# Altium project 开发板.PrjPCB
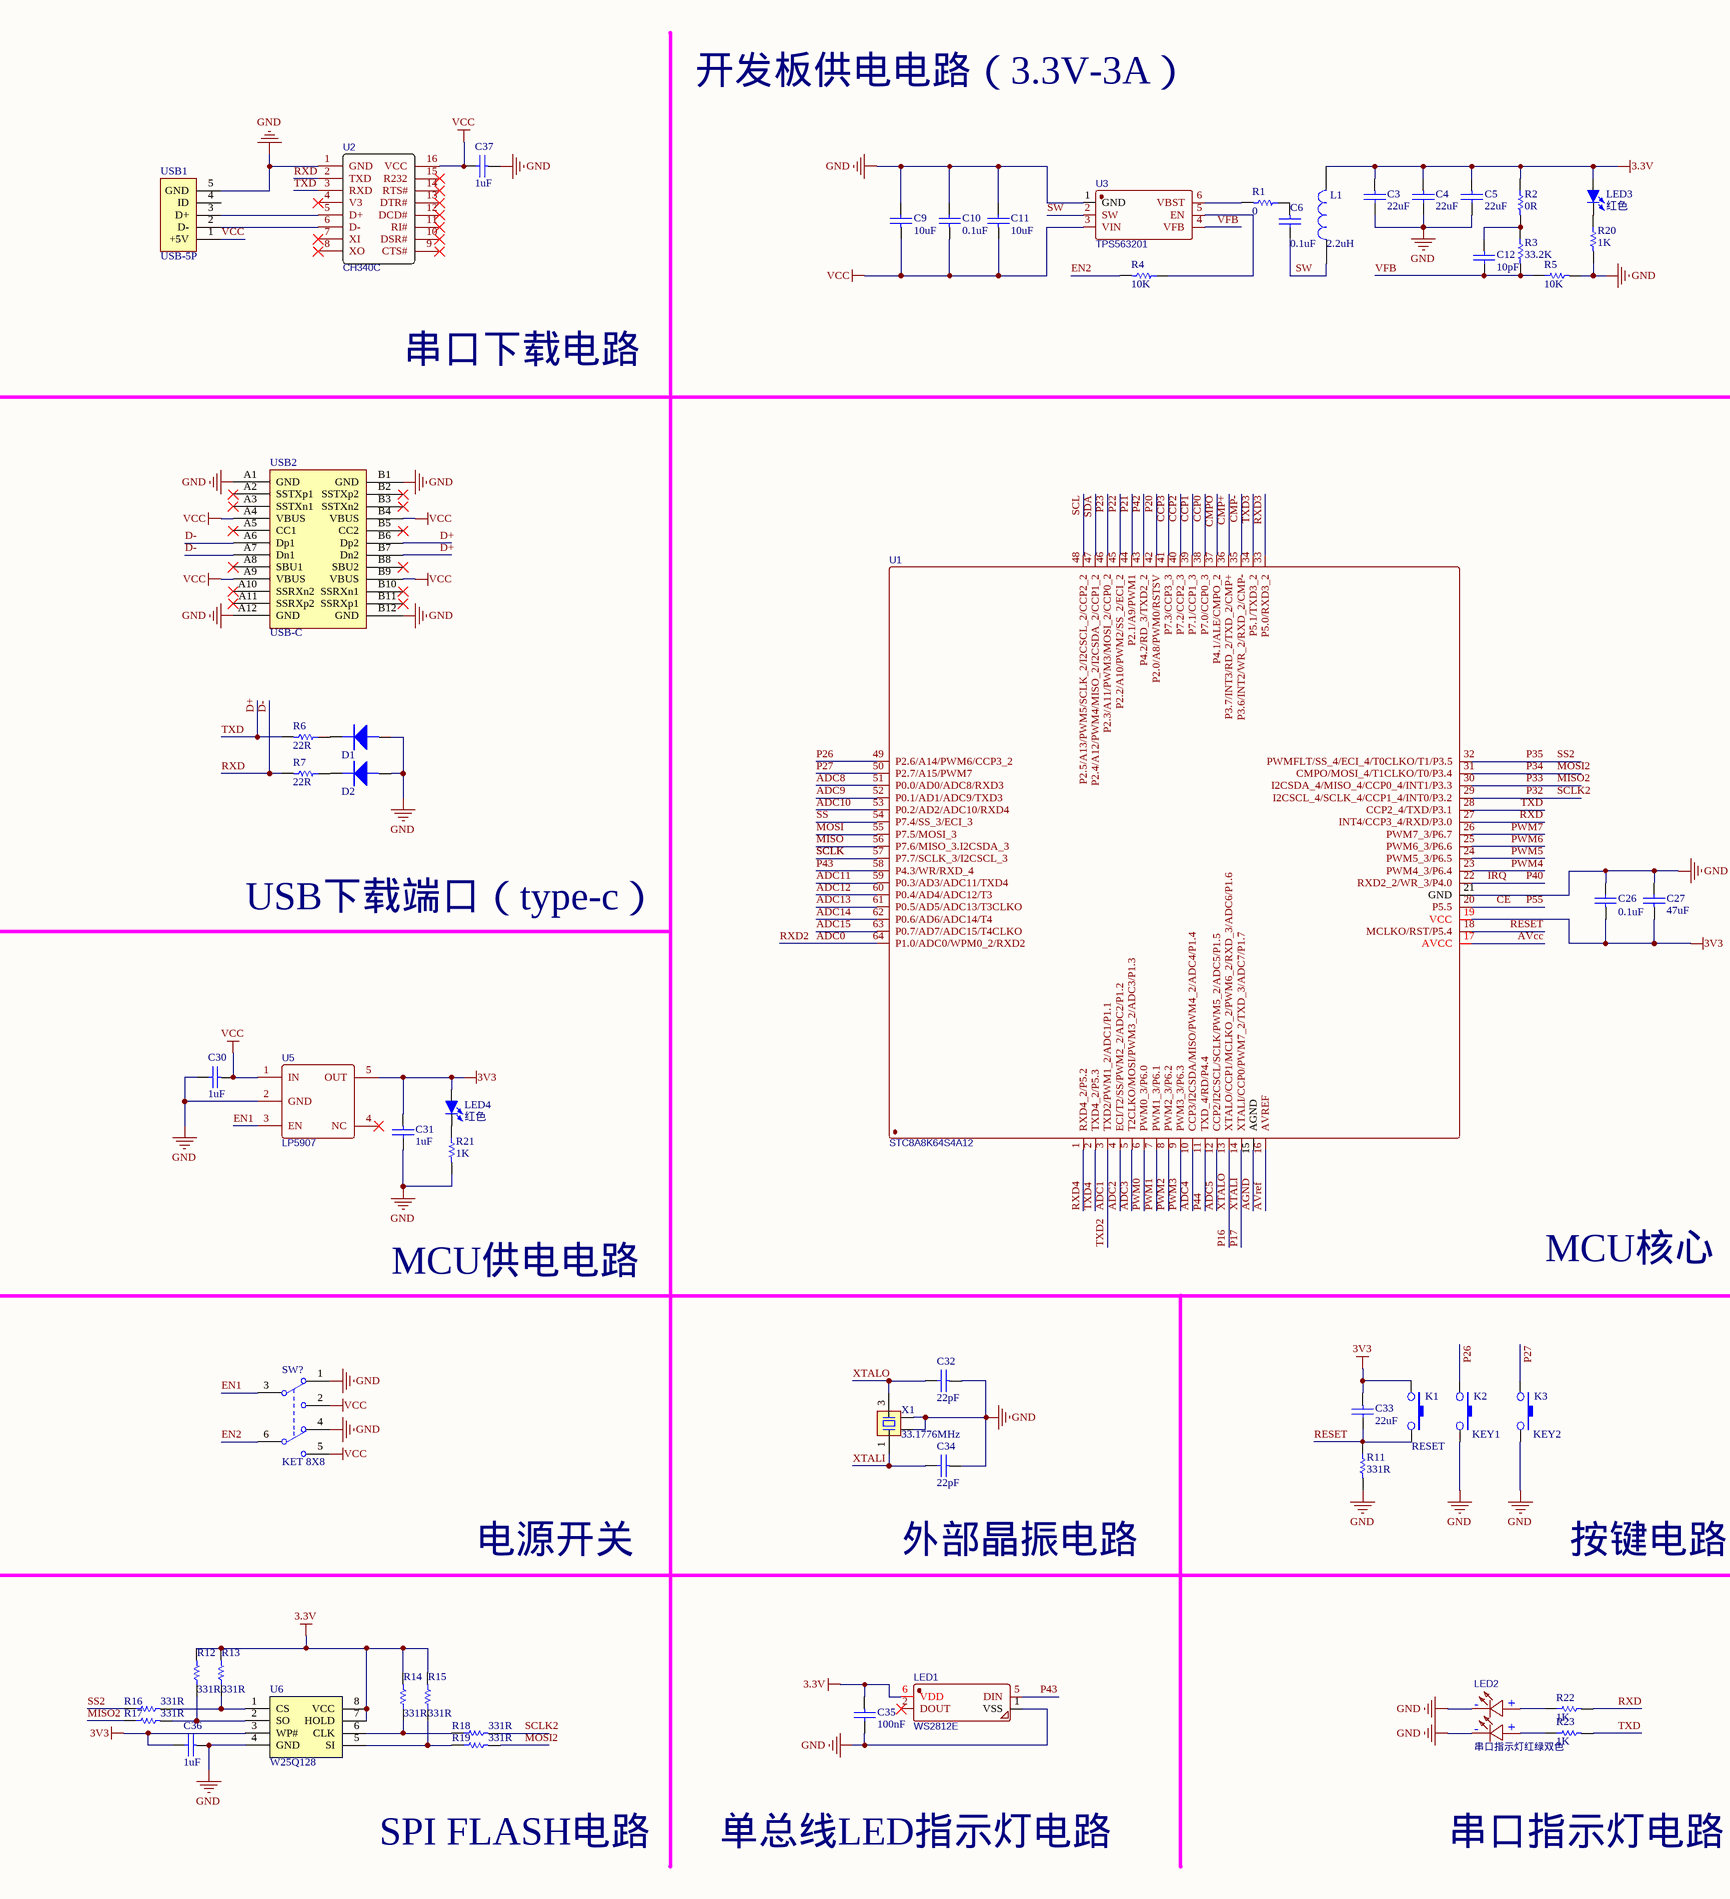
[diagram p0: 开发板.SchDoc, left]
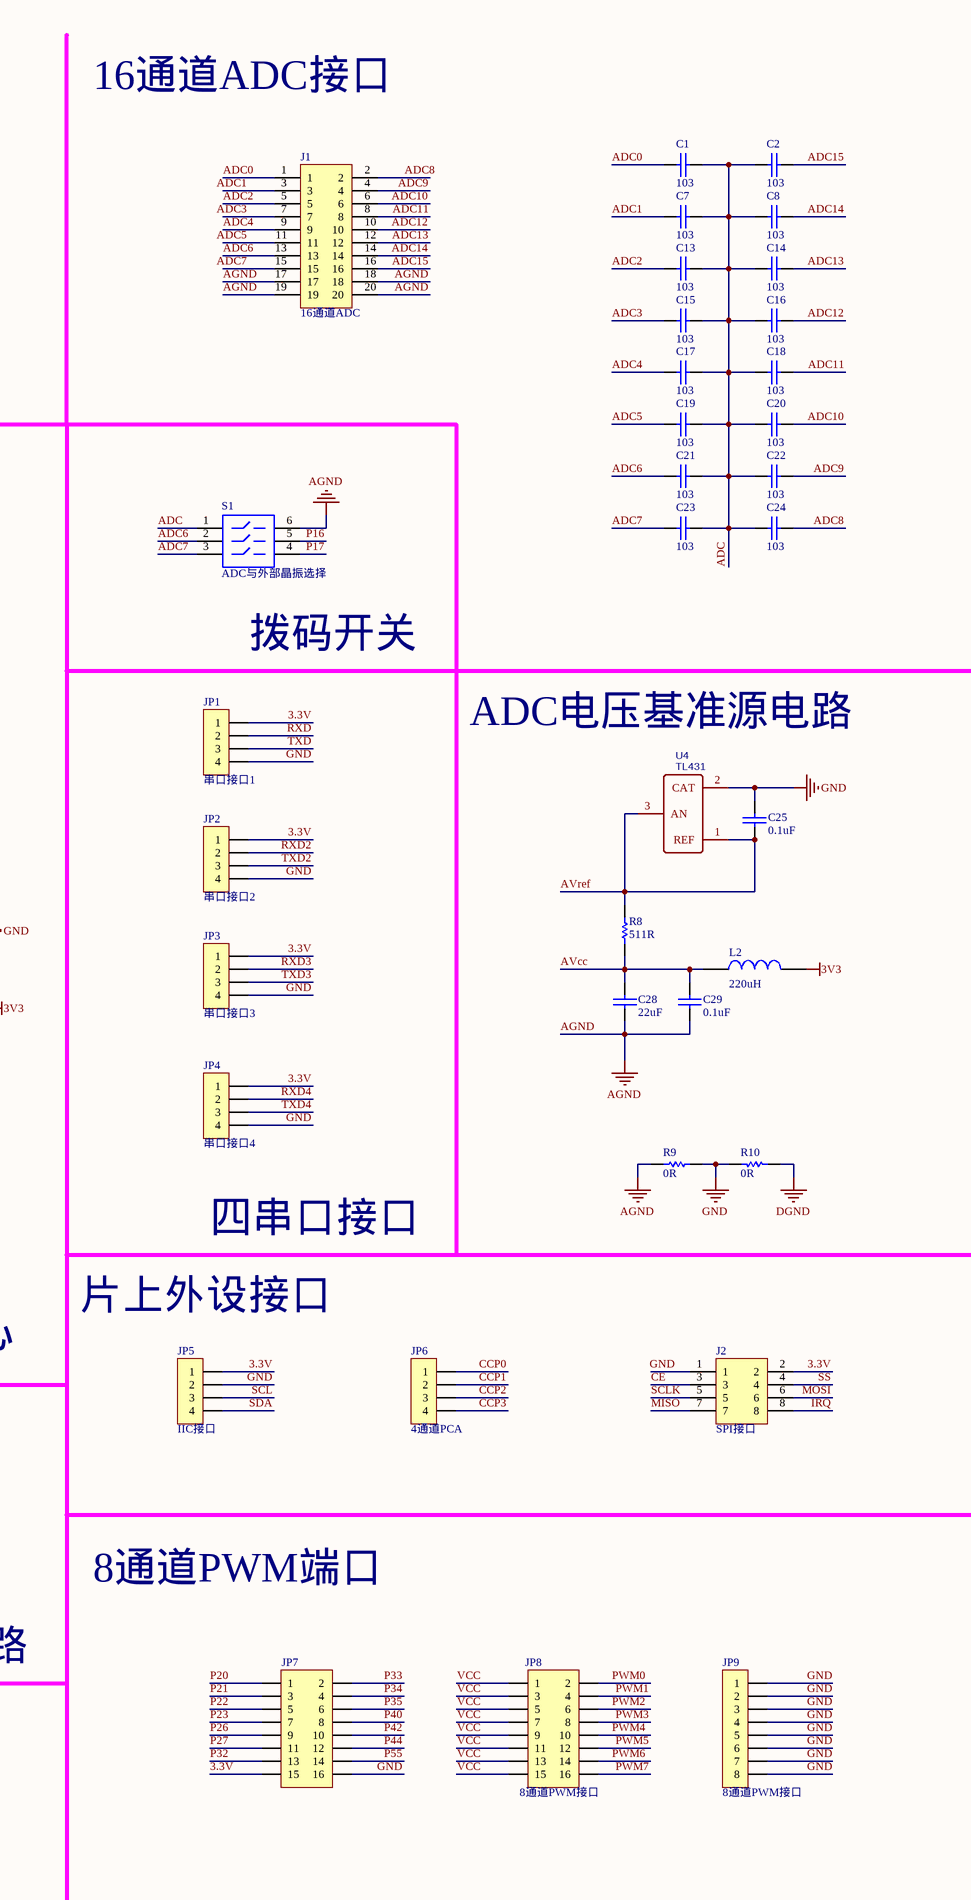
[diagram p1: 开发板.SchDoc, right]
1 sheet, 93 parts. Net scope: global (net labels, ports and power ports of the same name join across sheets).
Board file: 开发板.PcbDoc

## Sheet 开发板.SchDoc
size A2

### Parts
C1  103  [0603C]
C2  103  [0603C]
C3  22uF  [1206C]
C4  22uF  [1206C]
C5  22uF  [1206C]
C6  0.1uF  [0603C]
C7  103  [0603C]
C8  103  [0603C]
C9  10uF  [1206C]
C10  0.1uF  [0603C]
C11  10uF  [1206C]
C12  10pF  [0603C]
C13  103  [0603C]
C14  103  [0603C]
C15  103  [0603C]
C16  103  [0603C]
C17  103  [0603C]
C18  103  [0603C]
C19  103  [0603C]
C20  103  [0603C]
C21  103  [0603C]
C22  103  [0603C]
C23  103  [0603C]
C24  103  [0603C]
C25  0.1uF  [0603C]
C26  0.1uF  [0603C]
C27  47uF  [0603C]
C28  22uF  [0603C]
C29  0.1uF  [0603C]
C30  1uF  [0603C]
C31  1uF  [0603C]
C32  22pF  [0603C]
C33  22uF  [1206C]
C34  22pF  [0603C]
C35  100nF  [0603C]
C36  1uF  [0603C]
C37  1uF  [0603C]
D1  DIODE  [LL34]  (value not drawn)
D2  DIODE  [LL34]  (value not drawn)
J1  16通道ADC  [Pin HDR2X10/2.54mm-S]
J2  SPI接口  [Fe-HDR2X4/2.54-S]
JP1  串口接口1  [HDR2.54-LI-4P]
JP2  串口接口2  [HDR2.54-LI-4P]
JP3  串口接口3  [HDR2.54-LI-4P]
JP4  串口接口4  [HDR2.54-LI-4P]
JP5  IIC接口  [HDR2.54-M-LI-4P]
JP6  4通道PCA  [HDR2.54-LI-4P]
JP7  Header 8X2  [HDR2.54-LI-2x8P]  (value not drawn)
JP8  8通道PWM接口  [HDR2.54-LI-2x8P]
JP9  8通道PWM接口  [HDR2.54-LI-8P]
K1  RESET  [SMD-3X6X4.3]
K2  KEY1  [SMD-3X6X4.3]
K3  KEY2  [SMD-3X6X4.3]
L1  2.2uH  [CD32]
L2  220uH  [0603L]
LED1  WS2812E  [LED 5050]
LED2  串口指示灯红绿双色  [LED 1615-R/B]
LED3  红色  [LED 0603Y]
LED4  红色  [LED 0603R]
R1  0  [0603R]
R2  0R  [0603R]
R3  33.2K  [0603R]
R4  10K  [0603R]
R5  10K  [0603R]
R6  22R  [0603R]
R7  22R  [0603R]
R8  511R  [0603R]
R9  0R  [0603R]
R10  0R  [0603R]
R11  331R  [0603R]
R12  331R  [0603R]
R13  331R  [0603R]
R14  331R  [0603R]
R15  331R  [0603R]
R16  331R  [0603R]
R17  331R  [0603R]
R18  331R  [0603R]
R19  331R  [0603R]
R20  1K  [0603R]
R21  1K  [0603R]
R22  1K  [0603R]
R23  1K  [0603R]
S1  ADC与外部晶振选择  [DIP-Switch3]
SW?  KET 8X8  [KFT DIP-8X8]
U1  STC8A8K64S4A12  [LQFP64-10*10]
U2  CH340C  [SOP16]
U3  TPS563201  [SOT23-6]
U4  TL431  [SOT23]
U5  LP5907  [SOT23-5]
U6  W25Q128  [SOIC8]
USB1  USB-5P  [USB-MICRO_B]
USB2  USB-C  [USB-C/S_A]
X1  33.1776MHz  [OSC 1612-4P]

### Nets
3.3V: C3.1 C4.1 C5.1 C35.1 J2.2 JP1.1 JP2.1 JP3.1 JP4.1 JP5.1 JP7.15 L1.2 LED1.6(VDD) LED3.1(A) R2.1 R12.2 R13.2 R14.2 R15.2 U6.7(HOLD) U6.8(VCC)
3V3: C26.1 C27.1 C31.1 C33.1 C36.2 K1.1 L2.1 LED4.1(A) U1.19(VCC) U5.5(OUT) U6.3(WP#)
AGND: C28.1 C29.1 J1.17 J1.18 J1.19 J1.20 R9.2 S1.6(B1) U1.15(AGND)
DGND: R10.2
GND: C3.2 C4.2 C5.2 C9.2 C10.2 C11.2 C25.2 C26.2 C27.2 C30.2 C31.2 C32.1 C34.1 C35.2 C36.1 C37.1 D1.A D2.A J2.1 JP1.4 JP2.4 JP3.4 JP4.4 JP5.2 JP7.16 JP9.1 JP9.2 JP9.3 JP9.4 JP9.5 JP9.6 JP9.7 JP9.8 K2.3 K3.3 LED1.1(VSS) LED2.2 LED2.4 R5.2 R9.1 R10.1 R11.2 R20.2 R21.2 SW?.1(NC1) SW?.4(NO2) U1.21(GND) U2.1(GND) U3.1(GND) U4.2(CAT) U5.2(GND) U6.4(GND) USB1.5(GND) USB2.A1(GND) USB2.A12(GND) USB2.B1(GND) USB2.B12(GND) X1.2 X1.4
VCC: C9.1 C10.1 C11.1 C30.1 C37.2 JP8.1 JP8.3 JP8.5 JP8.7 JP8.9 JP8.11 JP8.13 JP8.15 SW?.2(COM2) SW?.5(COM2) U2.16(VCC) U3.3(VIN) U5.1(IN) USB1.1(+5V) USB2.A4(VBUS) USB2.A9(VBUS) USB2.B4(VBUS) USB2.B9(VBUS)
ADC: C1.2 C2.1 C7.2 C8.1 C13.2 C14.1 C15.2 C16.1 C17.2 C18.1 C19.2 C20.1 C21.2 C22.1 C23.2 C24.1 S1.1(A1)
ADC0: C1.1 J1.1 JP2.2 U1.64(P1.0/ADC0/WPM0_2/RXD2)  [also labelled RXD2]
ADC1: C7.1 J1.3 JP2.3 U1.3(TXD2/PWM1_2/ADC1/P1.1)  [also labelled TXD2]
ADC2: C13.1 J1.5 U1.4(ECI/T2/SS/PWM2_2/ADC2/P1.2)
ADC3: C15.1 J1.7 U1.5(T2CLKO/MOSI/PWM3_2/ADC3/P1.3)
ADC4: C17.1 J1.9 U1.10(CCP3/I2CSDA/MISO/PWM4_2/ADC4/P1.4)
ADC5: C19.1 J1.11 U1.12(CCP2/I2CSCL/SCLK/PWM5_2/ADC5/P1.5)
ADC6: C21.1 J1.13 S1.2(A2)
ADC7: C23.1 J1.15 S1.3(A3)
ADC8: C24.2 J1.2 U1.51(P0.0/AD0/ADC8/RXD3)
ADC9: C22.2 J1.4 U1.52(P0.1/AD1/ADC9/TXD3)
ADC10: C20.2 J1.6 U1.53(P0.2/AD2/ADC10/RXD4)
ADC11: C18.2 J1.8 U1.59(P0.3/AD3/ADC11/TXD4)
ADC12: C16.2 J1.10 U1.60(P0.4/AD4/ADC12/T3)
ADC13: C14.2 J1.12 U1.61(P0.5/AD5/ADC13/T3CLKO)
ADC14: C8.2 J1.14 U1.62(P0.6/AD6/ADC14/T4)
ADC15: C2.2 J1.16 U1.63(P0.7/AD7/ADC15/T4CLKO)
AVcc: C28.2 C29.2 L2.2 R8.1 U1.17(AVCC)
AVref: C25.1 R8.2 U1.16(AVREF) U4.1(REF) U4.3(AN)
CCP0: JP6.1 U1.38(P7.0/CCP0_3)
CCP1: JP6.2 U1.39(P7.1/CCP1_3)
CCP2: JP6.3 U1.40(P7.2/CCP2_3)
CCP3: JP6.4 U1.41(P7.3/CCP3_3)
CE: J2.3 JP7.14 U1.20(P5.5)  [also labelled P55]
CMP+: U1.36(P3.7/INT3/RD_2/TXD_2/CMP+)
CMP-: U1.35(P3.6/INT2/WR_2/RXD_2/CMP-)
CMPO: U1.37(P4.1/ALE/CMPO_2)
D+: JP1.3 R6.2 R23.2 U1.28(CCP2_4/TXD/P3.1) U2.3(RXD) USB2.B6(Dp2) USB2.B7(Dn2)  [also labelled TXD]
D-: JP1.2 R7.2 R22.2 U1.27(INT4/CCP3_4/RXD/P3.0) U2.2(TXD) USB2.A6(Dp1) USB2.A7(Dn1)  [also labelled RXD]
EN1: SW?.3(NO1) U5.3(EN)
EN2: R4.2 SW?.6(NC2)
IRQ: J2.8 JP7.8 U1.22(RXD2_2/WR_3/P4.0)  [also labelled P40]
MISO: J2.7 U1.56(P7.6/MISO_3.I2CSDA_3)
MISO2: JP7.2 R17.1 U1.30(I2CSDA_4/MISO_4/CCP0_4/INT1/P3.3)  [also labelled P33]
MOSI: J2.6 U1.55(P7.5/MOSI_3)
MOSI2: JP7.4 R19.2 U1.31(CMPO/MOSI_4/T1CLKO/T0/P3.4)  [also labelled P34]
P16: C32.2 S1.5(B2) U1.13(XTALO/CCP1/MCLKO_2/PWM6_2/RXD_3/ADC6/P1.6) X1.3  [also labelled XTALO]
P17: C34.2 S1.4(B3) U1.14(XTALI/CCP0/PWM7_2/TXD_3/ADC7/P1.7) X1.1  [also labelled XTALI]
P20: JP7.1 U1.42(P2.0/A8/PWM0/RSTSV)
P21: JP7.3 U1.44(P2.1/A9/PWM1)
P22: JP7.5 U1.45(P2.2/A10/PWM2/SS_2/ECI_2)
P23: JP7.7 U1.46(P2.3/A11/PWM3/MOSI_2/CCP0_2)
P26: JP7.9 K2.1 U1.49(P2.6/A14/PWM6/CCP3_2)
P27: JP7.11 K3.1 U1.50(P2.7/A15/PWM7)
P32: JP7.13 R18.2 U1.29(I2CSCL_4/SCLK_4/CCP1_4/INT0/P3.2)  [also labelled SCLK2]
P35: JP7.6 R16.1 U1.32(PWMFLT/SS_4/ECI_4/T0CLKO/T1/P3.5)  [also labelled SS2]
P42: JP7.10 U1.43(P4.2/RD_3/TXD2_2)
P43: LED1.5(DIN) U1.58(P4.3/WR/RXD_4)
P44: JP7.12 U1.11(TXD_4/RD/P4.4)
PWM0: JP8.2 U1.6(PWM0_3/P6.0)
PWM1: JP8.4 U1.7(PWM1_3/P6.1)
PWM2: JP8.6 U1.8(PWM2_3/P6.2)
PWM3: JP8.8 U1.9(PWM3_3/P6.3)
PWM4: JP8.10 U1.23(PWM4_3/P6.4)
PWM5: JP8.12 U1.24(PWM5_3/P6.5)
PWM6: JP8.14 U1.25(PWM6_3/P6.6)
PWM7: JP8.16 U1.26(PWM7_3/P6.7)
RESET: C33.2 K1.3 R11.1 U1.18(MCLKO/RST/P5.4)
RXD3: JP3.2 U1.33(P5.0/RXD3_2)
RXD4: JP4.2 U1.1(RXD4_2/P5.2)
SCL: JP5.3 U1.48(P2.5/A13/PWM5/SCLK_2/I2CSCL_2/CCP2_2)
SCLK: J2.5 U1.57(P7.7/SCLK_3/I2CSCL_3)
SDA: JP5.4 U1.47(P2.4/A12/PWM4/MISO_2/I2CSDA_2/CCP1_2)
SS: J2.4 U1.54(P7.4/SS_3/ECI_3)
SW: C6.2 L1.1 U3.2(SW)
TXD3: JP3.3 U1.34(P5.1/TXD3_2)
TXD4: JP4.3 U1.2(TXD4_2/P5.3)
VFB: C12.2 R3.2 R5.1 U3.4(VFB)
NetC6_1: C6.1 R1.1
NetC12_1: C12.1 R2.2 R3.1
NetD1_K: D1.K R6.1
NetD2_K: D2.K R7.1
NetLED2_1: LED2.1 R22.1
NetLED2_3: LED2.3 R23.1
NetLED3_2: LED3.2(K) R20.1
NetLED4_2: LED4.2(K) R21.1
NetR1_2: R1.2 U3.6(VBST)
NetR4_1: R4.1 U3.5(EN)
NetR12_1: R12.1 R17.2 U6.2(SO)
NetR13_1: R13.1 R16.2 U6.1(CS)
NetR14_1: R14.1 R18.1 U6.6(CLK)
NetR15_1: R15.1 R19.1 U6.5(SI)
NetU2_5: U2.5(D+) USB1.3(D+)
NetU2_6: U2.6(D-) USB1.2(D-)

Not connected (* = marked no-connect by the designer): LED1 2(DOUT)*; U2 4(V3)* 7(XI)* 8(XO)* 9(CTS#)* 10(DSR#)* 11(RI#)* 12(DCD#)* 13(DTR#)* 14(RTS#)* 15(R232)*; U5 4(NC)*; USB1 4(ID); USB2 A2(SSTXp1)* A3(SSTXn1)* A5(CC1)* A8(SBU1)* A10(SSRXn2)* A11(SSRXp2)* B2(SSTXp2)* B3(SSTXn2)* B5(CC2)* B8(SBU2)* B10(SSRXn1)* B11(SSRXp1)*

### Notes on the sheet
- 开发板供电电路（3.3V-3A）
- 16通道ADC接口
- 串口下载电路
- 拨码开关
- ADC电压基准源电路
- USB下载端口（type-c）
- 四串口接口
- 片上外设接口
- MCU供电电路
- MCU核心
- 8通道PWM端口
- 电源开关
- 外部晶振电路
- 按键电路
- SPI FLASH电路
- 单总线LED指示灯电路
- 串口指示灯电路
- (in symbol TJ-S1615SW6TGLCRY-A5) -; +

### Library data of the parts
C1-C37 = CAP: 无极性电容
D1 D2 = DIODE: 普通二极管
J1 = Pin HDR2X10
J2 = Female HDR2X4
JP1-JP6 = Header 4: 4P接插件; 版权归属: 源创客; BOM名称: 4P接插件; 学习资源: www.ooocke.com
JP7 JP8 = Header 8X2: 8*2P接插件; 版权归属: 源创客; BOM名称: 8*2P接插件; 学习资源: www.ooocke.com
JP9 = Header 8: 8P接插件; 版权归属: 源创客; BOM名称: 8P接插件; 学习资源: www.ooocke.com
K1-K3 = KEY
L1 L2 = INDUCTOR
LED1 = WS2812E: BOM_Manufacturer: Worldsemi; Contributor: LCSC; SMT Type: Extend; BOM_Supplier: LCSC; BOM_Supplier Part: C139127; BOM_Manufacturer Part: WS2812E; BOM_LCSC Assembly: Yes; spicePre: L; spiceSymbolName: WS2812E
LED2 = TJ-S1615SW6TGLCRY-A5: BOM_Manufacturer: TOGIALED; Contributor: LCSC; BOM_Supplier: LCSC; BOM_Supplier Part: C273606; BOM_Manufacturer Part: TJ-S1615SW6TGLCRY-A5; spicePre: L; spiceSymbolName: TJ-S1615SW6TGLCRY-A5
LED3 LED4 = LED-SMD: 贴片LED; 版权归属: 源创客; BOM名称: 贴片LED; 学习资源: www.ooocke.com
R1-R23 = RES
S1 = SW3-DIP6
SW? = KET 8X8: 8*8自锁开关; 版权归属: 源创客; BOM名称: 8*8自锁开关; 学习资源: www.ooocke.com
U1 = STC8A8K64S4A12: BOM_Manufacturer: STC; SMT Type: Extend; BOM_Supplier: LCSC; BOM_Manufacturer Part: STC8A8K64S4A12; BOM_Supplier Part: C86615; BOM_LCSC Assembly: Yes; spicePre: U; spiceSymbolName: STC8A8K64S4A12
U2 = CH340C: BOM_Manufacturer: WCH; SMT Type: Extend; BOM_Supplier: LCSC; BOM_Manufacturer Part: CH340C; BOM_Supplier Part: C84681; BOM_LCSC Assembly: Yes; spicePre: U; spiceSymbolName: CH340C
U3 = TPS563201DDCR: BOM_Manufacturer: Texas Instruments; Contributor: LCSC; SMT Type: Extend; BOM_Supplier: LCSC; BOM_Supplier Part: C116592; BOM_Manufacturer Part: TPS563201DDCR; BOM_LCSC Assembly: Yes; spicePre: U; spiceSymbolName: TPS563201DDCR
U4 = TL431: BOM_Manufacturer: SK; SMT Type: Extend; BOM_Supplier: LCSC; BOM_Manufacturer Part: TL431; BOM_Supplier Part: C111578; BOM_LCSC Assembly: Yes; spicePre: U; spiceSymbolName: TL431
U5 = LP5907QMFX-3.0Q1: BOM_Manufacturer: TI; Contributor: LCSC; SMT Type: Extend; BOM_Supplier: LCSC; BOM_Manufacturer Part: LP5907QMFX-3.0Q1; BOM_Supplier Part: C132018; BOM_LCSC Assembly: Yes; spicePre: U; spiceSymbolName: LP5907QMFX-3.0Q1
USB1 = USB-5P: 微型USB母座; 版权归属: 源创客; BOM名称: 微型USB母座; 学习资源: www.ooocke.com
USB2 = USB-C/S: USB-C型母接口; 版权归属: 源创客; BOM名称: USB-C型母接口; 学习资源: www.ooocke.com
X1 = XTAL-4P: 4脚无源晶振